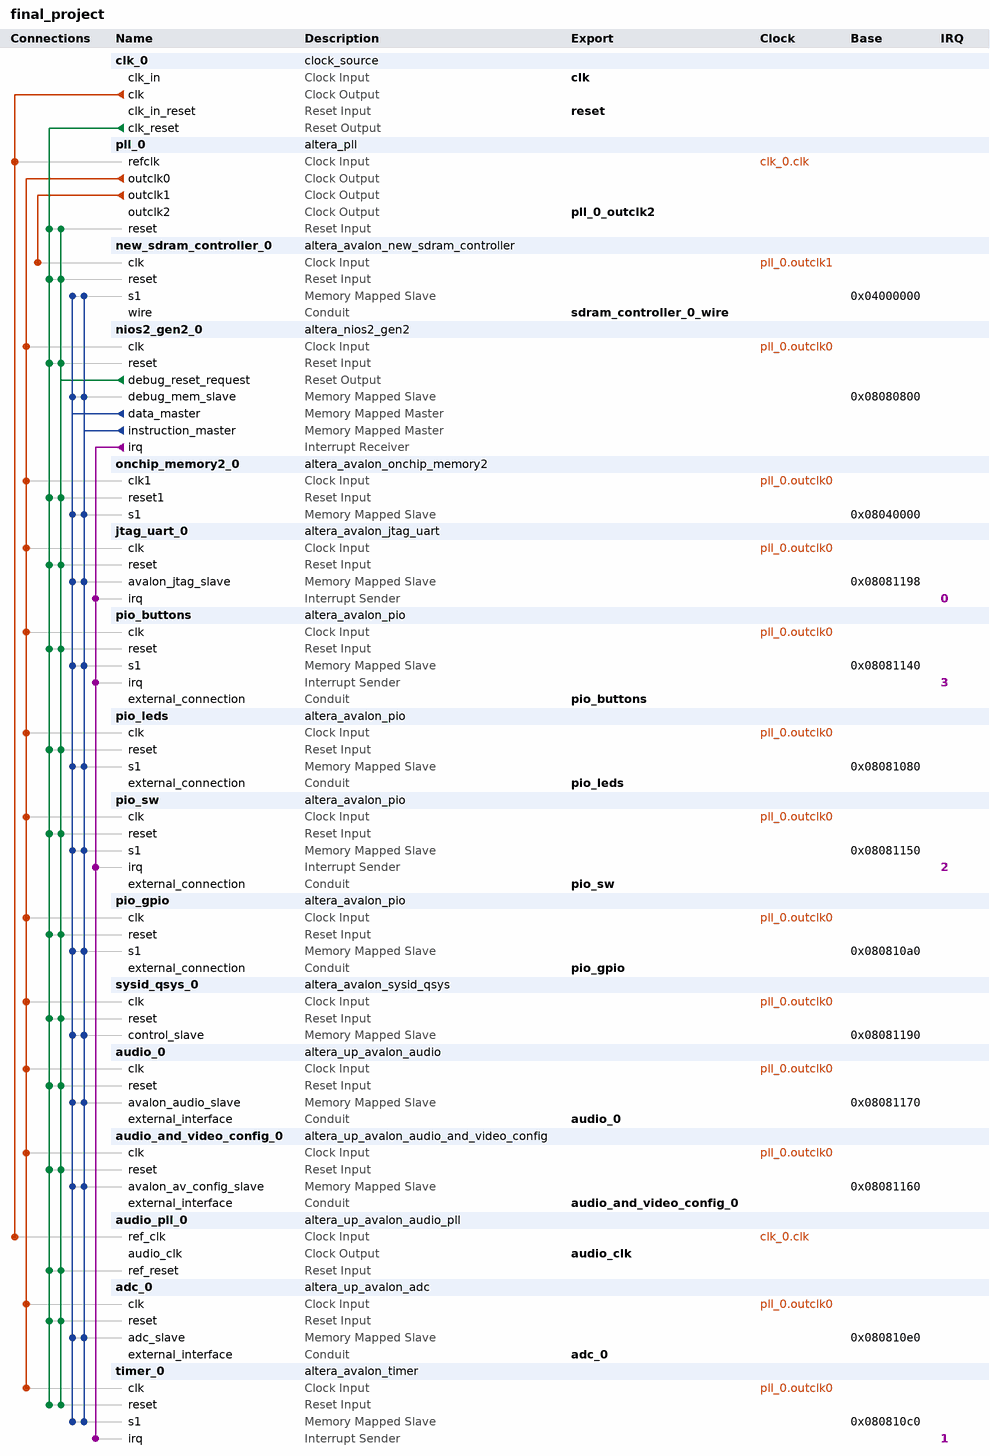
[diagram p0: system contents]
# Platform Designer (Qsys) system final_project, Cyclone V 5CSEMA5F31C6
# Parameters at their usual value, and those the tool derives, are not listed.
package require -exact qsys 18.1
create_system final_project
set_project_property DEVICE_FAMILY {Cyclone V}
set_project_property DEVICE 5CSEMA5F31C6

add_instance clk_0 clock_source 18.1
set_instance_parameter_value clk_0 clockFrequency 50000000

add_instance pll_0 altera_pll 18.1
set_instance_parameter_value pll_0 gui_device_speed_grade 1
set_instance_parameter_value pll_0 gui_number_of_clocks 3
set_instance_parameter_value pll_0 gui_operation_mode normal
set_instance_parameter_value pll_0 gui_output_clock_frequency0 50.0
set_instance_parameter_value pll_0 gui_output_clock_frequency1 100.0
set_instance_parameter_value pll_0 gui_output_clock_frequency2 100.0
set_instance_parameter_value pll_0 gui_phase_shift2 -3758
set_instance_parameter_value pll_0 gui_pll_mode {Integer-N PLL}
set_instance_parameter_value pll_0 gui_reference_clock_frequency 50.0
set_instance_parameter_value pll_0 gui_use_locked false

add_instance new_sdram_controller_0 altera_avalon_new_sdram_controller 18.1
set_instance_parameter_value new_sdram_controller_0 TAC 5.4
set_instance_parameter_value new_sdram_controller_0 TRCD 15.0
set_instance_parameter_value new_sdram_controller_0 TRP 15.0
set_instance_parameter_value new_sdram_controller_0 casLatency 3
set_instance_parameter_value new_sdram_controller_0 columnWidth 10
set_instance_parameter_value new_sdram_controller_0 dataWidth 16
set_instance_parameter_value new_sdram_controller_0 generateSimulationModel false
set_instance_parameter_value new_sdram_controller_0 model single_Micron_MT48LC4M32B2_7_chip
set_instance_parameter_value new_sdram_controller_0 numberOfBanks 4
set_instance_parameter_value new_sdram_controller_0 numberOfChipSelects 1
set_instance_parameter_value new_sdram_controller_0 powerUpDelay 100.0
set_instance_parameter_value new_sdram_controller_0 refreshPeriod 7.8125
set_instance_parameter_value new_sdram_controller_0 rowWidth 13

add_instance nios2_gen2_0 altera_nios2_gen2 18.1
set_instance_parameter_value nios2_gen2_0 dcache_size 2048
set_instance_parameter_value nios2_gen2_0 exceptionSlave onchip_memory2_0.s1
set_instance_parameter_value nios2_gen2_0 icache_size 4096
set_instance_parameter_value nios2_gen2_0 impl Fast
set_instance_parameter_value nios2_gen2_0 resetSlave onchip_memory2_0.s1

add_instance onchip_memory2_0 altera_avalon_onchip_memory2 18.1
set_instance_parameter_value onchip_memory2_0 dataWidth 32
set_instance_parameter_value onchip_memory2_0 dualPort false
set_instance_parameter_value onchip_memory2_0 initMemContent true
set_instance_parameter_value onchip_memory2_0 initializationFileName onchip_mem.hex
set_instance_parameter_value onchip_memory2_0 memorySize 262144

add_instance jtag_uart_0 altera_avalon_jtag_uart 18.1
set_instance_parameter_value jtag_uart_0 simInteractiveOptions NO_INTERACTIVE_WINDOWS

add_instance pio_buttons altera_avalon_pio 18.1
set_instance_parameter_value pio_buttons bitClearingEdgeCapReg true
set_instance_parameter_value pio_buttons captureEdge true
set_instance_parameter_value pio_buttons direction Input
set_instance_parameter_value pio_buttons edgeType FALLING
set_instance_parameter_value pio_buttons generateIRQ true
set_instance_parameter_value pio_buttons irqType EDGE
set_instance_parameter_value pio_buttons width 4

add_instance pio_leds altera_avalon_pio 18.1
set_instance_parameter_value pio_leds bitModifyingOutReg true
set_instance_parameter_value pio_leds direction Output
set_instance_parameter_value pio_leds width 10

add_instance pio_sw altera_avalon_pio 18.1
set_instance_parameter_value pio_sw captureEdge true
set_instance_parameter_value pio_sw direction Input
set_instance_parameter_value pio_sw generateIRQ true
set_instance_parameter_value pio_sw irqType EDGE
set_instance_parameter_value pio_sw width 10

add_instance pio_gpio altera_avalon_pio 18.1
set_instance_parameter_value pio_gpio bitModifyingOutReg true
set_instance_parameter_value pio_gpio captureEdge true
set_instance_parameter_value pio_gpio direction Output
set_instance_parameter_value pio_gpio generateIRQ true
set_instance_parameter_value pio_gpio irqType EDGE
set_instance_parameter_value pio_gpio width 16

add_instance sysid_qsys_0 altera_avalon_sysid_qsys 18.1
set_instance_parameter_value sysid_qsys_0 id 0

add_instance audio_0 altera_up_avalon_audio 18.0
set_instance_parameter_value audio_0 audio_in true
set_instance_parameter_value audio_0 avalon_bus_type {Memory Mapped}
set_instance_parameter_value audio_0 dw 16

add_instance audio_and_video_config_0 altera_up_avalon_audio_and_video_config 18.0
set_instance_parameter_value audio_and_video_config_0 audio_in {Microphone to ADC}
set_instance_parameter_value audio_and_video_config_0 bit_length 16
set_instance_parameter_value audio_and_video_config_0 board DE1-SoC
set_instance_parameter_value audio_and_video_config_0 line_in_bypass false
set_instance_parameter_value audio_and_video_config_0 sampling_rate {48 kHz}

add_instance audio_pll_0 altera_up_avalon_audio_pll 18.0
set_instance_parameter_value audio_pll_0 gui_refclk 50.0

add_instance adc_0 altera_up_avalon_adc 18.0
set_instance_parameter_value adc_0 board DE1-SoC
set_instance_parameter_value adc_0 numch_ 1

add_instance timer_0 altera_avalon_timer 18.1
set_instance_parameter_value timer_0 period 1
set_instance_parameter_value timer_0 periodUnits MSEC

# connections
add_connection clk_0.clk audio_pll_0.ref_clk clock
add_connection clk_0.clk pll_0.refclk clock
add_connection pll_0.outclk0 adc_0.clk clock
add_connection pll_0.outclk0 audio_0.clk clock
add_connection pll_0.outclk0 audio_and_video_config_0.clk clock
add_connection pll_0.outclk0 jtag_uart_0.clk clock
add_connection pll_0.outclk0 nios2_gen2_0.clk clock
add_connection pll_0.outclk0 onchip_memory2_0.clk1 clock
add_connection pll_0.outclk0 pio_buttons.clk clock
add_connection pll_0.outclk0 pio_gpio.clk clock
add_connection pll_0.outclk0 pio_leds.clk clock
add_connection pll_0.outclk0 pio_sw.clk clock
add_connection pll_0.outclk0 sysid_qsys_0.clk clock
add_connection pll_0.outclk0 timer_0.clk clock
add_connection pll_0.outclk1 new_sdram_controller_0.clk clock
add_connection clk_0.clk_reset adc_0.reset reset
add_connection clk_0.clk_reset audio_0.reset reset
add_connection clk_0.clk_reset audio_and_video_config_0.reset reset
add_connection clk_0.clk_reset audio_pll_0.ref_reset reset
add_connection clk_0.clk_reset jtag_uart_0.reset reset
add_connection clk_0.clk_reset new_sdram_controller_0.reset reset
add_connection clk_0.clk_reset nios2_gen2_0.reset reset
add_connection clk_0.clk_reset onchip_memory2_0.reset1 reset
add_connection clk_0.clk_reset pio_buttons.reset reset
add_connection clk_0.clk_reset pio_gpio.reset reset
add_connection clk_0.clk_reset pio_leds.reset reset
add_connection clk_0.clk_reset pio_sw.reset reset
add_connection clk_0.clk_reset pll_0.reset reset
add_connection clk_0.clk_reset sysid_qsys_0.reset reset
add_connection clk_0.clk_reset timer_0.reset reset
add_connection nios2_gen2_0.debug_reset_request adc_0.reset reset
add_connection nios2_gen2_0.debug_reset_request audio_0.reset reset
add_connection nios2_gen2_0.debug_reset_request audio_and_video_config_0.reset reset
add_connection nios2_gen2_0.debug_reset_request audio_pll_0.ref_reset reset
add_connection nios2_gen2_0.debug_reset_request jtag_uart_0.reset reset
add_connection nios2_gen2_0.debug_reset_request new_sdram_controller_0.reset reset
add_connection nios2_gen2_0.debug_reset_request nios2_gen2_0.reset reset
add_connection nios2_gen2_0.debug_reset_request onchip_memory2_0.reset1 reset
add_connection nios2_gen2_0.debug_reset_request pio_buttons.reset reset
add_connection nios2_gen2_0.debug_reset_request pio_gpio.reset reset
add_connection nios2_gen2_0.debug_reset_request pio_leds.reset reset
add_connection nios2_gen2_0.debug_reset_request pio_sw.reset reset
add_connection nios2_gen2_0.debug_reset_request pll_0.reset reset
add_connection nios2_gen2_0.debug_reset_request sysid_qsys_0.reset reset
add_connection nios2_gen2_0.debug_reset_request timer_0.reset reset
add_connection nios2_gen2_0.data_master adc_0.adc_slave avalon
set_connection_parameter_value nios2_gen2_0.data_master/adc_0.adc_slave baseAddress 0x080810e0
add_connection nios2_gen2_0.data_master audio_0.avalon_audio_slave avalon
set_connection_parameter_value nios2_gen2_0.data_master/audio_0.avalon_audio_slave baseAddress 0x08081170
add_connection nios2_gen2_0.data_master audio_and_video_config_0.avalon_av_config_slave avalon
set_connection_parameter_value nios2_gen2_0.data_master/audio_and_video_config_0.avalon_av_config_slave baseAddress 0x08081160
add_connection nios2_gen2_0.data_master jtag_uart_0.avalon_jtag_slave avalon
set_connection_parameter_value nios2_gen2_0.data_master/jtag_uart_0.avalon_jtag_slave baseAddress 0x08081198
add_connection nios2_gen2_0.data_master new_sdram_controller_0.s1 avalon
set_connection_parameter_value nios2_gen2_0.data_master/new_sdram_controller_0.s1 baseAddress 0x04000000
add_connection nios2_gen2_0.data_master nios2_gen2_0.debug_mem_slave avalon
set_connection_parameter_value nios2_gen2_0.data_master/nios2_gen2_0.debug_mem_slave baseAddress 0x08080800
add_connection nios2_gen2_0.data_master onchip_memory2_0.s1 avalon
set_connection_parameter_value nios2_gen2_0.data_master/onchip_memory2_0.s1 baseAddress 0x08040000
add_connection nios2_gen2_0.data_master pio_buttons.s1 avalon
set_connection_parameter_value nios2_gen2_0.data_master/pio_buttons.s1 baseAddress 0x08081140
add_connection nios2_gen2_0.data_master pio_gpio.s1 avalon
set_connection_parameter_value nios2_gen2_0.data_master/pio_gpio.s1 baseAddress 0x080810a0
add_connection nios2_gen2_0.data_master pio_leds.s1 avalon
set_connection_parameter_value nios2_gen2_0.data_master/pio_leds.s1 baseAddress 0x08081080
add_connection nios2_gen2_0.data_master pio_sw.s1 avalon
set_connection_parameter_value nios2_gen2_0.data_master/pio_sw.s1 baseAddress 0x08081150
add_connection nios2_gen2_0.data_master sysid_qsys_0.control_slave avalon
set_connection_parameter_value nios2_gen2_0.data_master/sysid_qsys_0.control_slave baseAddress 0x08081190
add_connection nios2_gen2_0.data_master timer_0.s1 avalon
set_connection_parameter_value nios2_gen2_0.data_master/timer_0.s1 baseAddress 0x080810c0
add_connection nios2_gen2_0.instruction_master adc_0.adc_slave avalon
set_connection_parameter_value nios2_gen2_0.instruction_master/adc_0.adc_slave baseAddress 0x080810e0
add_connection nios2_gen2_0.instruction_master audio_0.avalon_audio_slave avalon
set_connection_parameter_value nios2_gen2_0.instruction_master/audio_0.avalon_audio_slave baseAddress 0x08081170
add_connection nios2_gen2_0.instruction_master audio_and_video_config_0.avalon_av_config_slave avalon
set_connection_parameter_value nios2_gen2_0.instruction_master/audio_and_video_config_0.avalon_av_config_slave baseAddress 0x08081160
add_connection nios2_gen2_0.instruction_master jtag_uart_0.avalon_jtag_slave avalon
set_connection_parameter_value nios2_gen2_0.instruction_master/jtag_uart_0.avalon_jtag_slave baseAddress 0x08081198
add_connection nios2_gen2_0.instruction_master new_sdram_controller_0.s1 avalon
set_connection_parameter_value nios2_gen2_0.instruction_master/new_sdram_controller_0.s1 baseAddress 0x04000000
add_connection nios2_gen2_0.instruction_master nios2_gen2_0.debug_mem_slave avalon
set_connection_parameter_value nios2_gen2_0.instruction_master/nios2_gen2_0.debug_mem_slave baseAddress 0x08080800
add_connection nios2_gen2_0.instruction_master onchip_memory2_0.s1 avalon
set_connection_parameter_value nios2_gen2_0.instruction_master/onchip_memory2_0.s1 baseAddress 0x08040000
add_connection nios2_gen2_0.instruction_master pio_buttons.s1 avalon
set_connection_parameter_value nios2_gen2_0.instruction_master/pio_buttons.s1 baseAddress 0x08081140
add_connection nios2_gen2_0.instruction_master pio_gpio.s1 avalon
set_connection_parameter_value nios2_gen2_0.instruction_master/pio_gpio.s1 baseAddress 0x080810a0
add_connection nios2_gen2_0.instruction_master pio_leds.s1 avalon
set_connection_parameter_value nios2_gen2_0.instruction_master/pio_leds.s1 baseAddress 0x08081080
add_connection nios2_gen2_0.instruction_master pio_sw.s1 avalon
set_connection_parameter_value nios2_gen2_0.instruction_master/pio_sw.s1 baseAddress 0x08081150
add_connection nios2_gen2_0.instruction_master sysid_qsys_0.control_slave avalon
set_connection_parameter_value nios2_gen2_0.instruction_master/sysid_qsys_0.control_slave baseAddress 0x08081190
add_connection nios2_gen2_0.instruction_master timer_0.s1 avalon
set_connection_parameter_value nios2_gen2_0.instruction_master/timer_0.s1 baseAddress 0x080810c0
add_connection nios2_gen2_0.irq jtag_uart_0.irq interrupt
set_connection_parameter_value nios2_gen2_0.irq/jtag_uart_0.irq irqNumber 0
add_connection nios2_gen2_0.irq pio_buttons.irq interrupt
set_connection_parameter_value nios2_gen2_0.irq/pio_buttons.irq irqNumber 3
add_connection nios2_gen2_0.irq pio_sw.irq interrupt
set_connection_parameter_value nios2_gen2_0.irq/pio_sw.irq irqNumber 2
add_connection nios2_gen2_0.irq timer_0.irq interrupt
set_connection_parameter_value nios2_gen2_0.irq/timer_0.irq irqNumber 1

# exported interfaces
add_interface adc_0 conduit end
set_interface_property adc_0 EXPORT_OF adc_0.external_interface
add_interface audio_0 conduit end
set_interface_property audio_0 EXPORT_OF audio_0.external_interface
add_interface audio_and_video_config_0 conduit end
set_interface_property audio_and_video_config_0 EXPORT_OF audio_and_video_config_0.external_interface
add_interface audio_clk clock source
set_interface_property audio_clk EXPORT_OF audio_pll_0.audio_clk
add_interface clk clock sink
set_interface_property clk EXPORT_OF clk_0.clk_in
add_interface pio_buttons conduit end
set_interface_property pio_buttons EXPORT_OF pio_buttons.external_connection
add_interface pio_gpio conduit end
set_interface_property pio_gpio EXPORT_OF pio_gpio.external_connection
add_interface pio_leds conduit end
set_interface_property pio_leds EXPORT_OF pio_leds.external_connection
add_interface pio_sw conduit end
set_interface_property pio_sw EXPORT_OF pio_sw.external_connection
add_interface pll_0_outclk2 clock source
set_interface_property pll_0_outclk2 EXPORT_OF pll_0.outclk2
add_interface reset reset sink
set_interface_property reset EXPORT_OF clk_0.clk_in_reset
add_interface sdram_controller_0_wire conduit end
set_interface_property sdram_controller_0_wire EXPORT_OF new_sdram_controller_0.wire

set_interconnect_requirement {$system} qsys_mm.clockCrossingAdapter HANDSHAKE
set_interconnect_requirement {$system} qsys_mm.enableEccProtection FALSE
set_interconnect_requirement {$system} qsys_mm.insertDefaultSlave FALSE
set_interconnect_requirement {$system} qsys_mm.maxAdditionalLatency 1

save_system final_project.qsys
